# EasyEDA schematic SCH_ESP32_2023-08-31.json
TITLE: IoT-Refrigerator-Temperature-alarm; REV: 0.1; Date: 2022-03-07; Sheet: 1/1; Drawn By: RamiLup; Company: RamiLup
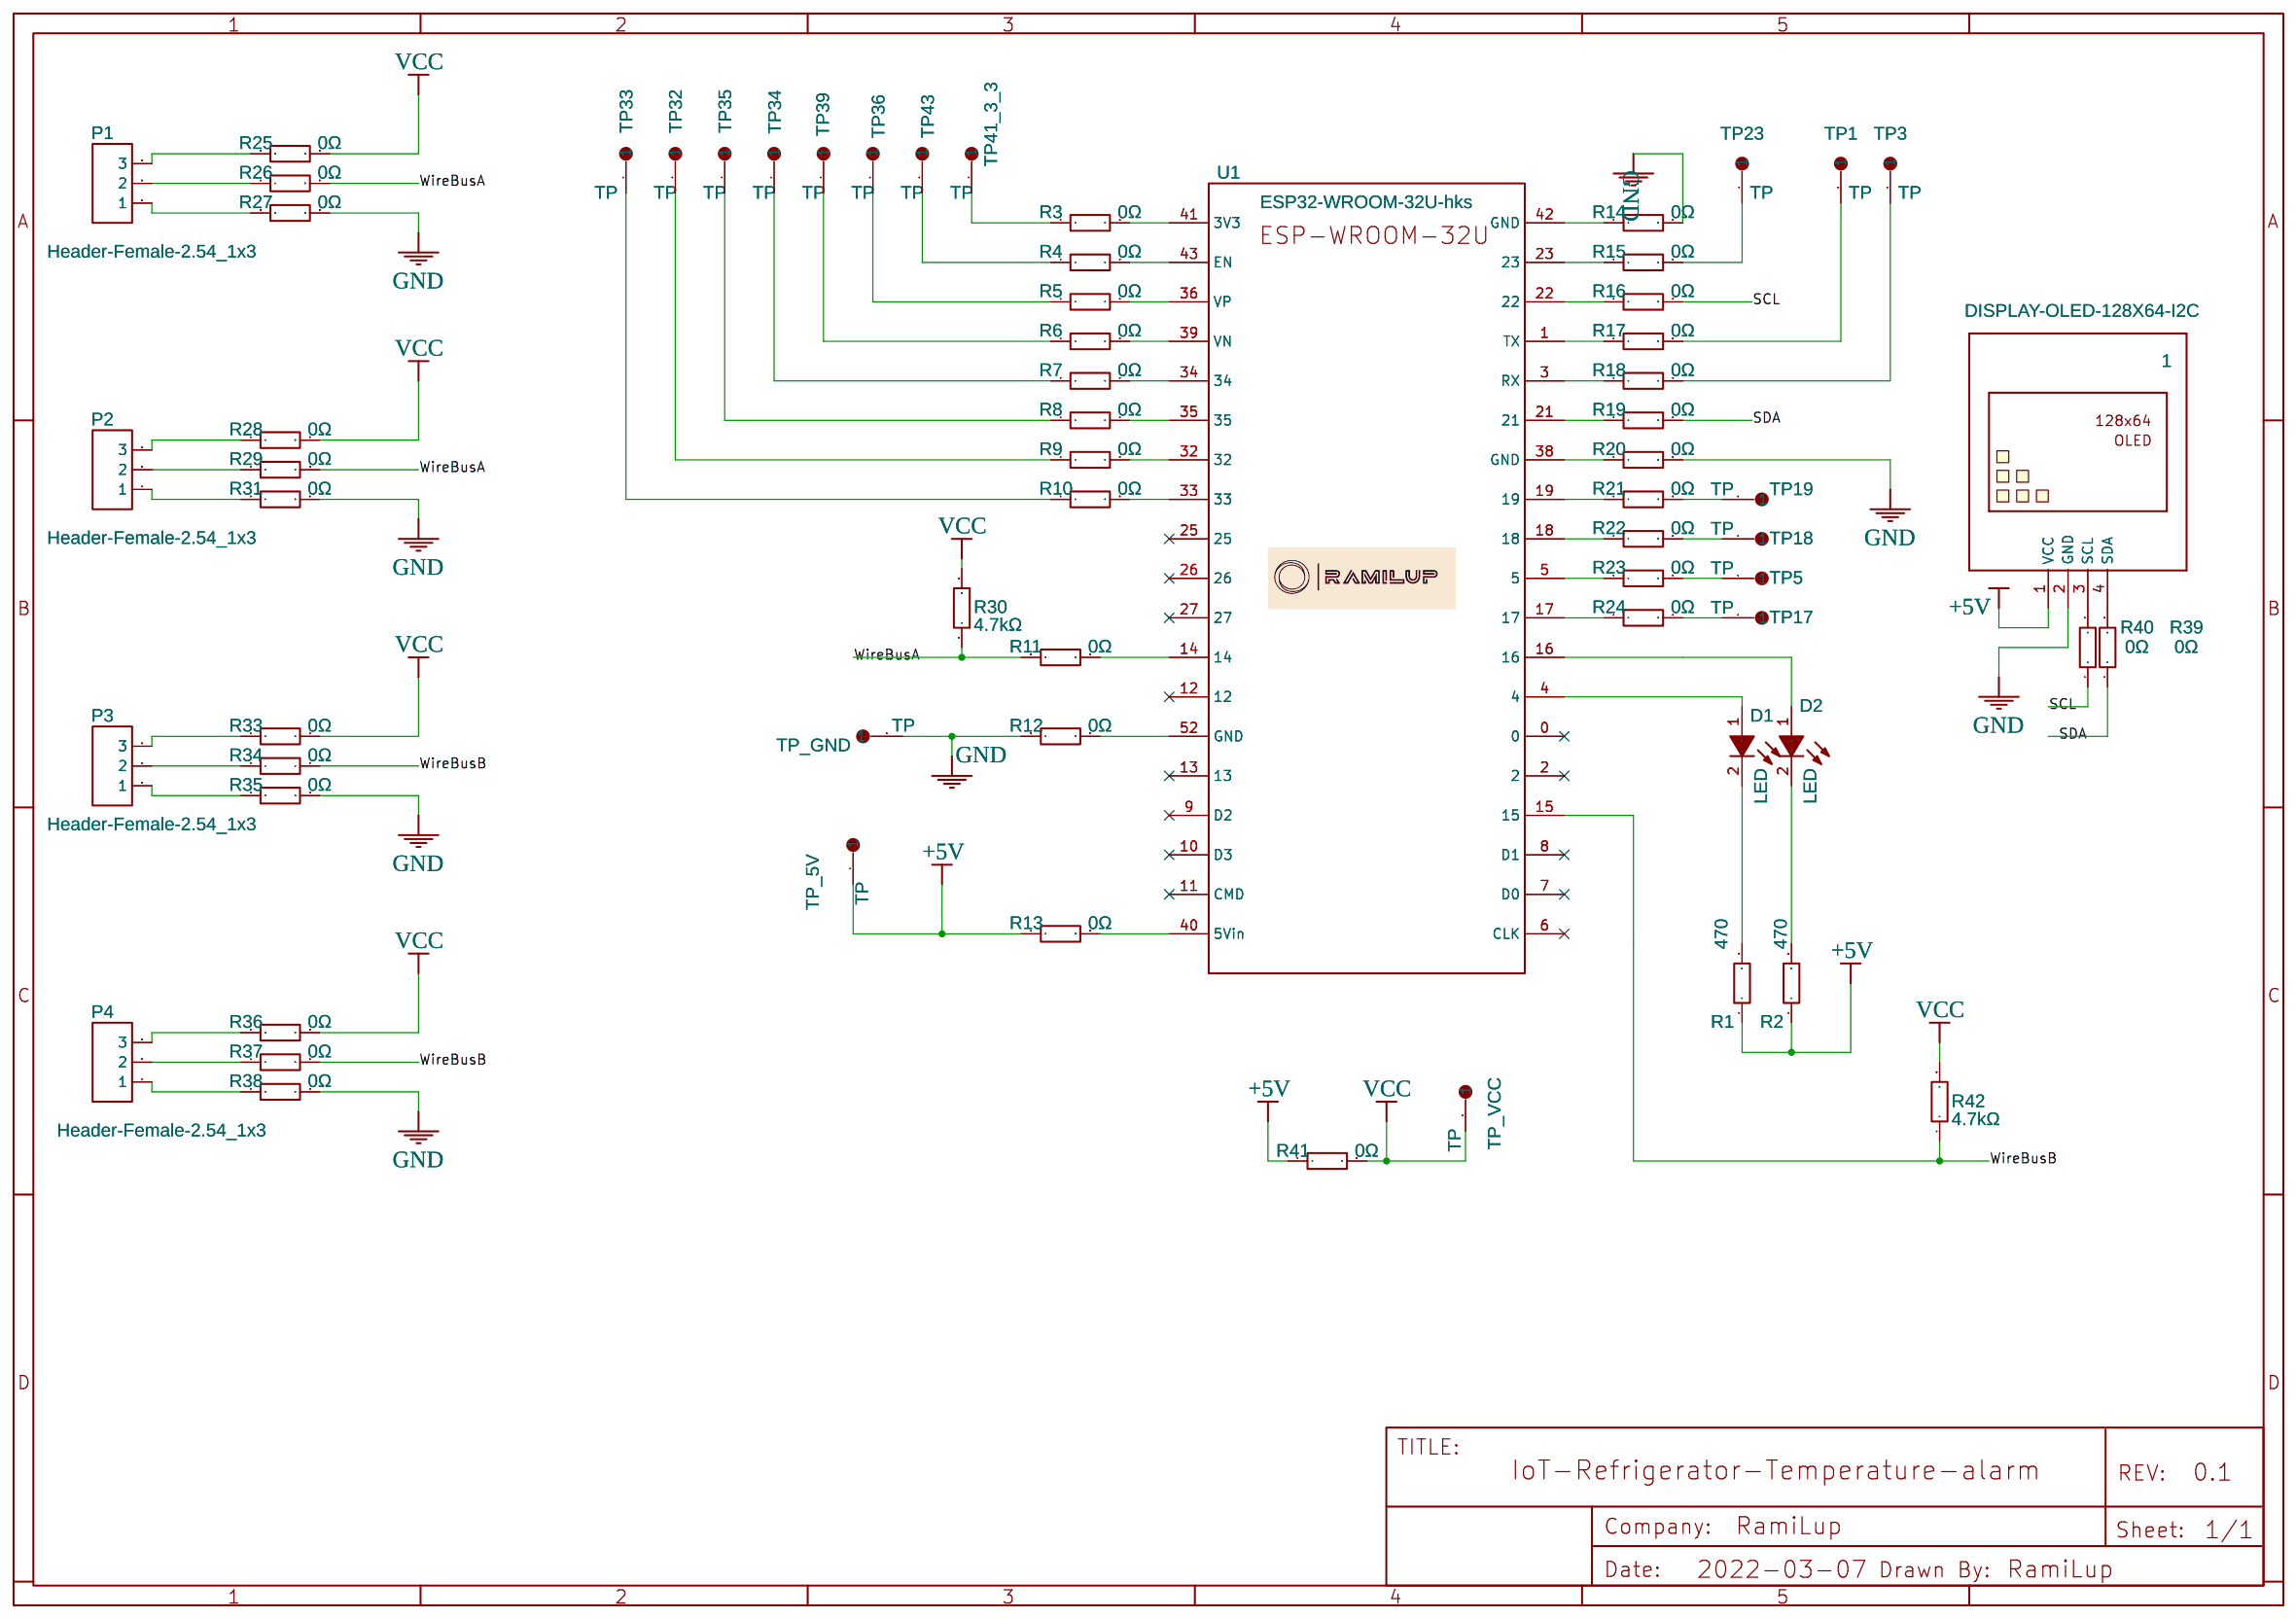
[diagram p0: schematic sheet]

## Parts
1  DISPLAY-OLED-128X64-I2C  [DISPLAY-OLED-128X64-I2C]
D1  LED  [LED-TH_LED-DP2-2LED]
D2  LED  [LED-TH_LED-DP2-2LED]
P1  Header-Female-2.54_1x3  [HDR-TH_3P-P2.54-V-F]
P2  Header-Female-2.54_1x3  [HDR-TH_3P-P2.54-V-F]
P3  Header-Female-2.54_1x3  [HDR-TH_3P-P2.54-V-F]
P4  Header-Female-2.54_1x3  [HDR-TH_3P-P2.54-V-F]
R1  470  [R2512]
R2  470  [R2512]
R3  0Ω  [R1206]
R4  0Ω  [R1206]
R5  0Ω  [R1206]
R6  0Ω  [R1206]
R7  0Ω  [R1206]
R8  0Ω  [R1206]
R9  0Ω  [R1206]
R10  0Ω  [R1206]
R11  0Ω  [R1206]
R12  0Ω  [R1206]
R13  0Ω  [R1206]
R14  0Ω  [R1206]
R15  0Ω  [R1206]
R16  0Ω  [R1206]
R17  0Ω  [R1206]
R18  0Ω  [R1206]
R19  0Ω  [R1206]
R20  0Ω  [R1206]
R21  0Ω  [R1206]
R22  0Ω  [R1206]
R23  0Ω  [R1206]
R24  0Ω  [R1206]
R25  0Ω  [R1206]
R26  0Ω  [R1206]
R27  0Ω  [R1206]
R28  0Ω  [R1206]
R29  0Ω  [R1206]
R30  4.7kΩ  [R2512]
R31  0Ω  [R1206]
R33  0Ω  [R1206]
R34  0Ω  [R1206]
R35  0Ω  [R1206]
R36  0Ω  [R1206]
R37  0Ω  [R1206]
R38  0Ω  [R1206]
R39  0Ω  [R1206]
R40  0Ω  [R1206]
R41  0Ω  [R2512]
R42  4.7kΩ  [R2512]
TP1  TP  [PKG-TEST-POINT-PTH-1X1]
TP3  TP  [PKG-TEST-POINT-PTH-1X1]
TP5  TP  [PKG-TEST-POINT-PTH-1X1]
TP17  TP  [PKG-TEST-POINT-PTH-1X1]
TP18  TP  [PKG-TEST-POINT-PTH-1X1]
TP19  TP  [PKG-TEST-POINT-PTH-1X1]
TP23  TP  [PKG-TEST-POINT-PTH-1X1]
TP32  TP  [PKG-TEST-POINT-PTH-1X1]
TP33  TP  [PKG-TEST-POINT-PTH-1X1]
TP34  TP  [PKG-TEST-POINT-PTH-1X1]
TP35  TP  [PKG-TEST-POINT-PTH-1X1]
TP36  TP  [PKG-TEST-POINT-PTH-1X1]
TP39  TP  [PKG-TEST-POINT-PTH-1X1]
TP41_3_3  TP  [PKG-TEST-POINT-PTH-1X1]
TP43  TP  [PKG-TEST-POINT-PTH-1X1]
TP_5V  TP  [PKG-TEST-POINT-PTH-1X1]
TP_GND  TP  [PKG-TEST-POINT-PTH-1X1]
TP_VCC  TP  [PKG-TEST-POINT-PTH-1X1]
U1  ESP32-WROOM-32U-hks  [ESP32-DEVKITC-V4-HKSMONAR2]

## Library data of the parts
1 = DISPLAY-OLED-128X64-I2C: Contributor: akilakavinda
D1 D2 = 3mm Green TH LED 5600: Supplier: Digi-Key; Manufacturer: VccLite; Manufacturer Part: 5600; Supplier Part: L20325-ND; link: https://vcclite.com/product/5602f5-5v/; Contributor: AlexKatsovich
P1-P4 = Header-Female-2.54_1x3: Supplier Part: C146243; Supplier: LCSC; Manufacturer: Boom Precision Elec; link: https://datasheet.lcsc.com/szlcsc/Boom-Precision-Elec-2-54mm-1-8P-Straight-Female-header_C27438.pdf; JLCPCB Part Class: Extended Part
R1 R2 = RC2512JK-07470RL: Supplier: LCSC; Supplier Part: C309617; Manufacturer: YAGEO; Contributor: LCSC; Resistance: 470Ω
R3-R29 R31 R33-R40 = RS-06000FT: Supplier: LCSC; Supplier Part: C140060; Manufacturer: Guangdong Fenghua Advanced Tech; Resistance (Ohms): 0; Contributor: LCSC; JLCPCB Part Class: Extended Part
R30 R42 = RMC25124.7K1%N: Supplier: LCSC; Supplier Part: C269368; Manufacturer: Tyohm; Resistance (Ohms): 4.7K; Contributor: LCSC; JLCPCB Part Class: Extended Part
R41 = RMC251205%N: Supplier: LCSC; Supplier Part: C269343; Manufacturer: Tyohm; Resistance (Ohms): 0; Contributor: LCSC; JLCPCB Part Class: Extended Part
TP1 TP3 TP5 TP17-TP19 TP23 TP32-TP36 TP39 TP41_3_3 TP43 TP_5V TP_GND TP_VCC = TEST-POINT-PTH-1X1
U1 = ESP32-WROOM-32U-hks: Manufacturer: Espressif Systems; Manufacturer Part: ESP32-DevKitC; Supplier Part: 356-ESP32-DEVKITC; link: http://esp-idf.readthedocs.io/en/latest/get-started/get-started-devkitc.html; Contributor: hksmonaro; Package Display: No

## Nets
+5V: 1.1(VCC) R1.1 R2.1 R13.1 R41.1 TP_5V.1
GND: 1.2(GND) R12.1 R14.2 R20.2 R27.2 R31.2 R35.2 R38.2 TP_GND.1
VCC: R25.2 R28.2 R30.2 R33.2 R36.2 R41.2 R42.2 TP_VCC.1
SCL: R16.2 R40.1
SDA: R19.2 R39.1
WireBusA: R11.1 R26.2 R29.2 R30.1
WireBusB: R34.2 R37.2 R42.1 U1.15
Net-(1-3): 1.3(SCL) R40.2
Net-(1-4): 1.4(SDA) R39.2
Net-(D1-1): D1.1(A) U1.4
Net-(D1-2): D1.2(K) R1.2
Net-(D2-1): D2.1(A) U1.16
Net-(D2-2): D2.2(K) R2.2
Net-(P1-1): P1.1 R27.1
Net-(P1-2): P1.2 R26.1
Net-(P1-3): P1.3 R25.1
Net-(P2-1): P2.1 R31.1
Net-(P2-2): P2.2 R29.1
Net-(P2-3): P2.3 R28.1
Net-(P3-1): P3.1 R35.1
Net-(P3-2): P3.2 R34.1
Net-(P3-3): P3.3 R33.1
Net-(P4-1): P4.1 R38.1
Net-(P4-2): P4.2 R37.1
Net-(P4-3): P4.3 R36.1
Net-(R3-1): R3.1 TP41_3_3.1
Net-(R3-2): R3.2 U1.41(3V3)
Net-(R4-1): R4.1 TP43.1
Net-(R4-2): R4.2 U1.43(EN)
Net-(R5-1): R5.1 TP36.1
Net-(R5-2): R5.2 U1.36(VP)
Net-(R6-1): R6.1 TP39.1
Net-(R6-2): R6.2 U1.39(VN)
Net-(R7-1): R7.1 TP34.1
Net-(R7-2): R7.2 U1.34
Net-(R8-1): R8.1 TP35.1
Net-(R8-2): R8.2 U1.35
Net-(R9-1): R9.1 TP32.1
Net-(R9-2): R9.2 U1.32
Net-(R10-1): R10.1 TP33.1
Net-(R10-2): R10.2 U1.33
Net-(R11-2): R11.2 U1.14
Net-(R12-2): R12.2 U1.52(GND)
Net-(R13-2): R13.2 U1.40(5Vin)
Net-(R14-1): R14.1 U1.42(GND)
Net-(R15-1): R15.1 U1.23
Net-(R15-2): R15.2 TP23.1
Net-(R16-1): R16.1 U1.22
Net-(R17-1): R17.1 U1.1(TX)
Net-(R17-2): R17.2 TP1.1
Net-(R18-1): R18.1 U1.3(RX)
Net-(R18-2): R18.2 TP3.1
Net-(R19-1): R19.1 U1.21
Net-(R20-1): R20.1 U1.38(GND)
Net-(R21-1): R21.1 U1.19
Net-(R21-2): R21.2 TP19.1
Net-(R22-1): R22.1 U1.18
Net-(R22-2): R22.2 TP18.1
Net-(R23-1): R23.1 U1.5
Net-(R23-2): R23.2 TP5.1
Net-(R24-1): R24.1 U1.17
Net-(R24-2): R24.2 TP17.1

Not connected (* = marked no-connect by the designer): U1 0* 2* 6(CLK)* 7(D0)* 8(D1)* 9(D2)* 10(D3)* 11(CMD)* 12* 13* 25* 26* 27*
